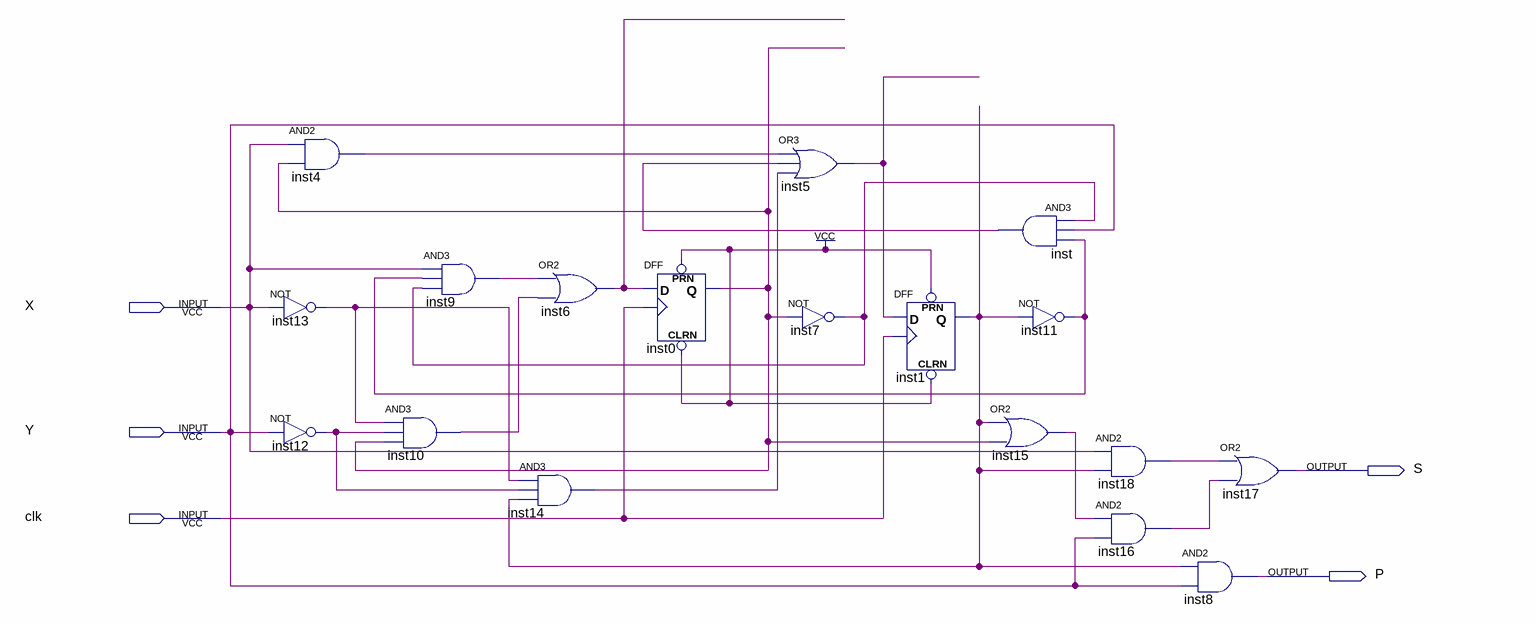
[diagram p0: schematic sheet]
// Quartus schematic autoseller.bdf as structural Verilog: 18 symbols, 5 pins
module autoseller (
  input  X,
  input  Y,
  input  clk,
  output S,
  output P
);

  wire inst0_q, inst1_q, inst4_out, inst5_out, inst6_out, inst7_out, inst9_out, inst10_out, inst11_out,
       inst12_out, inst13_out, inst14_out, inst15_out, inst16_out, inst18_out, inst_out;

  and inst4 (inst4_out, X, inst0_q);
  not inst13 (inst13_out, X);
  not inst12 (inst12_out, Y);
  and inst9 (inst9_out, X, inst11_out, inst7_out);
  and inst10 (inst10_out, inst13_out, inst12_out, inst0_q);
  and inst14 (inst14_out, inst13_out, inst12_out, inst1_q);
  or inst6 (inst6_out, inst9_out, inst10_out);
  DFF inst0 (.CLRN(1'b1), .CLK(clk), .D(inst6_out), .PRN(1'b1), .Q(inst0_q));
  or inst5 (inst5_out, inst4_out, inst_out, inst14_out);
  not inst7 (inst7_out, inst0_q);
  DFF inst1 (.CLRN(1'b1), .CLK(clk), .D(inst5_out), .PRN(1'b1), .Q(inst1_q));
  and inst (inst_out, inst7_out, Y, inst11_out);
  not inst11 (inst11_out, inst1_q);
  or inst15 (inst15_out, inst1_q, inst0_q);
  and inst18 (inst18_out, X, inst1_q);
  and inst16 (inst16_out, inst15_out, Y);
  and inst8 (P, inst1_q, Y);
  or inst17 (S, inst18_out, inst16_out);
endmodule
